# Altium schematic sheet BMS can bang thu dong 4N04R.SchDoc: BMS 300A G011N04
size 431 x 279 mm; CompanyName: AZE; Revision: 1.0.0; SheetNumber: 1; SheetTotal: 2
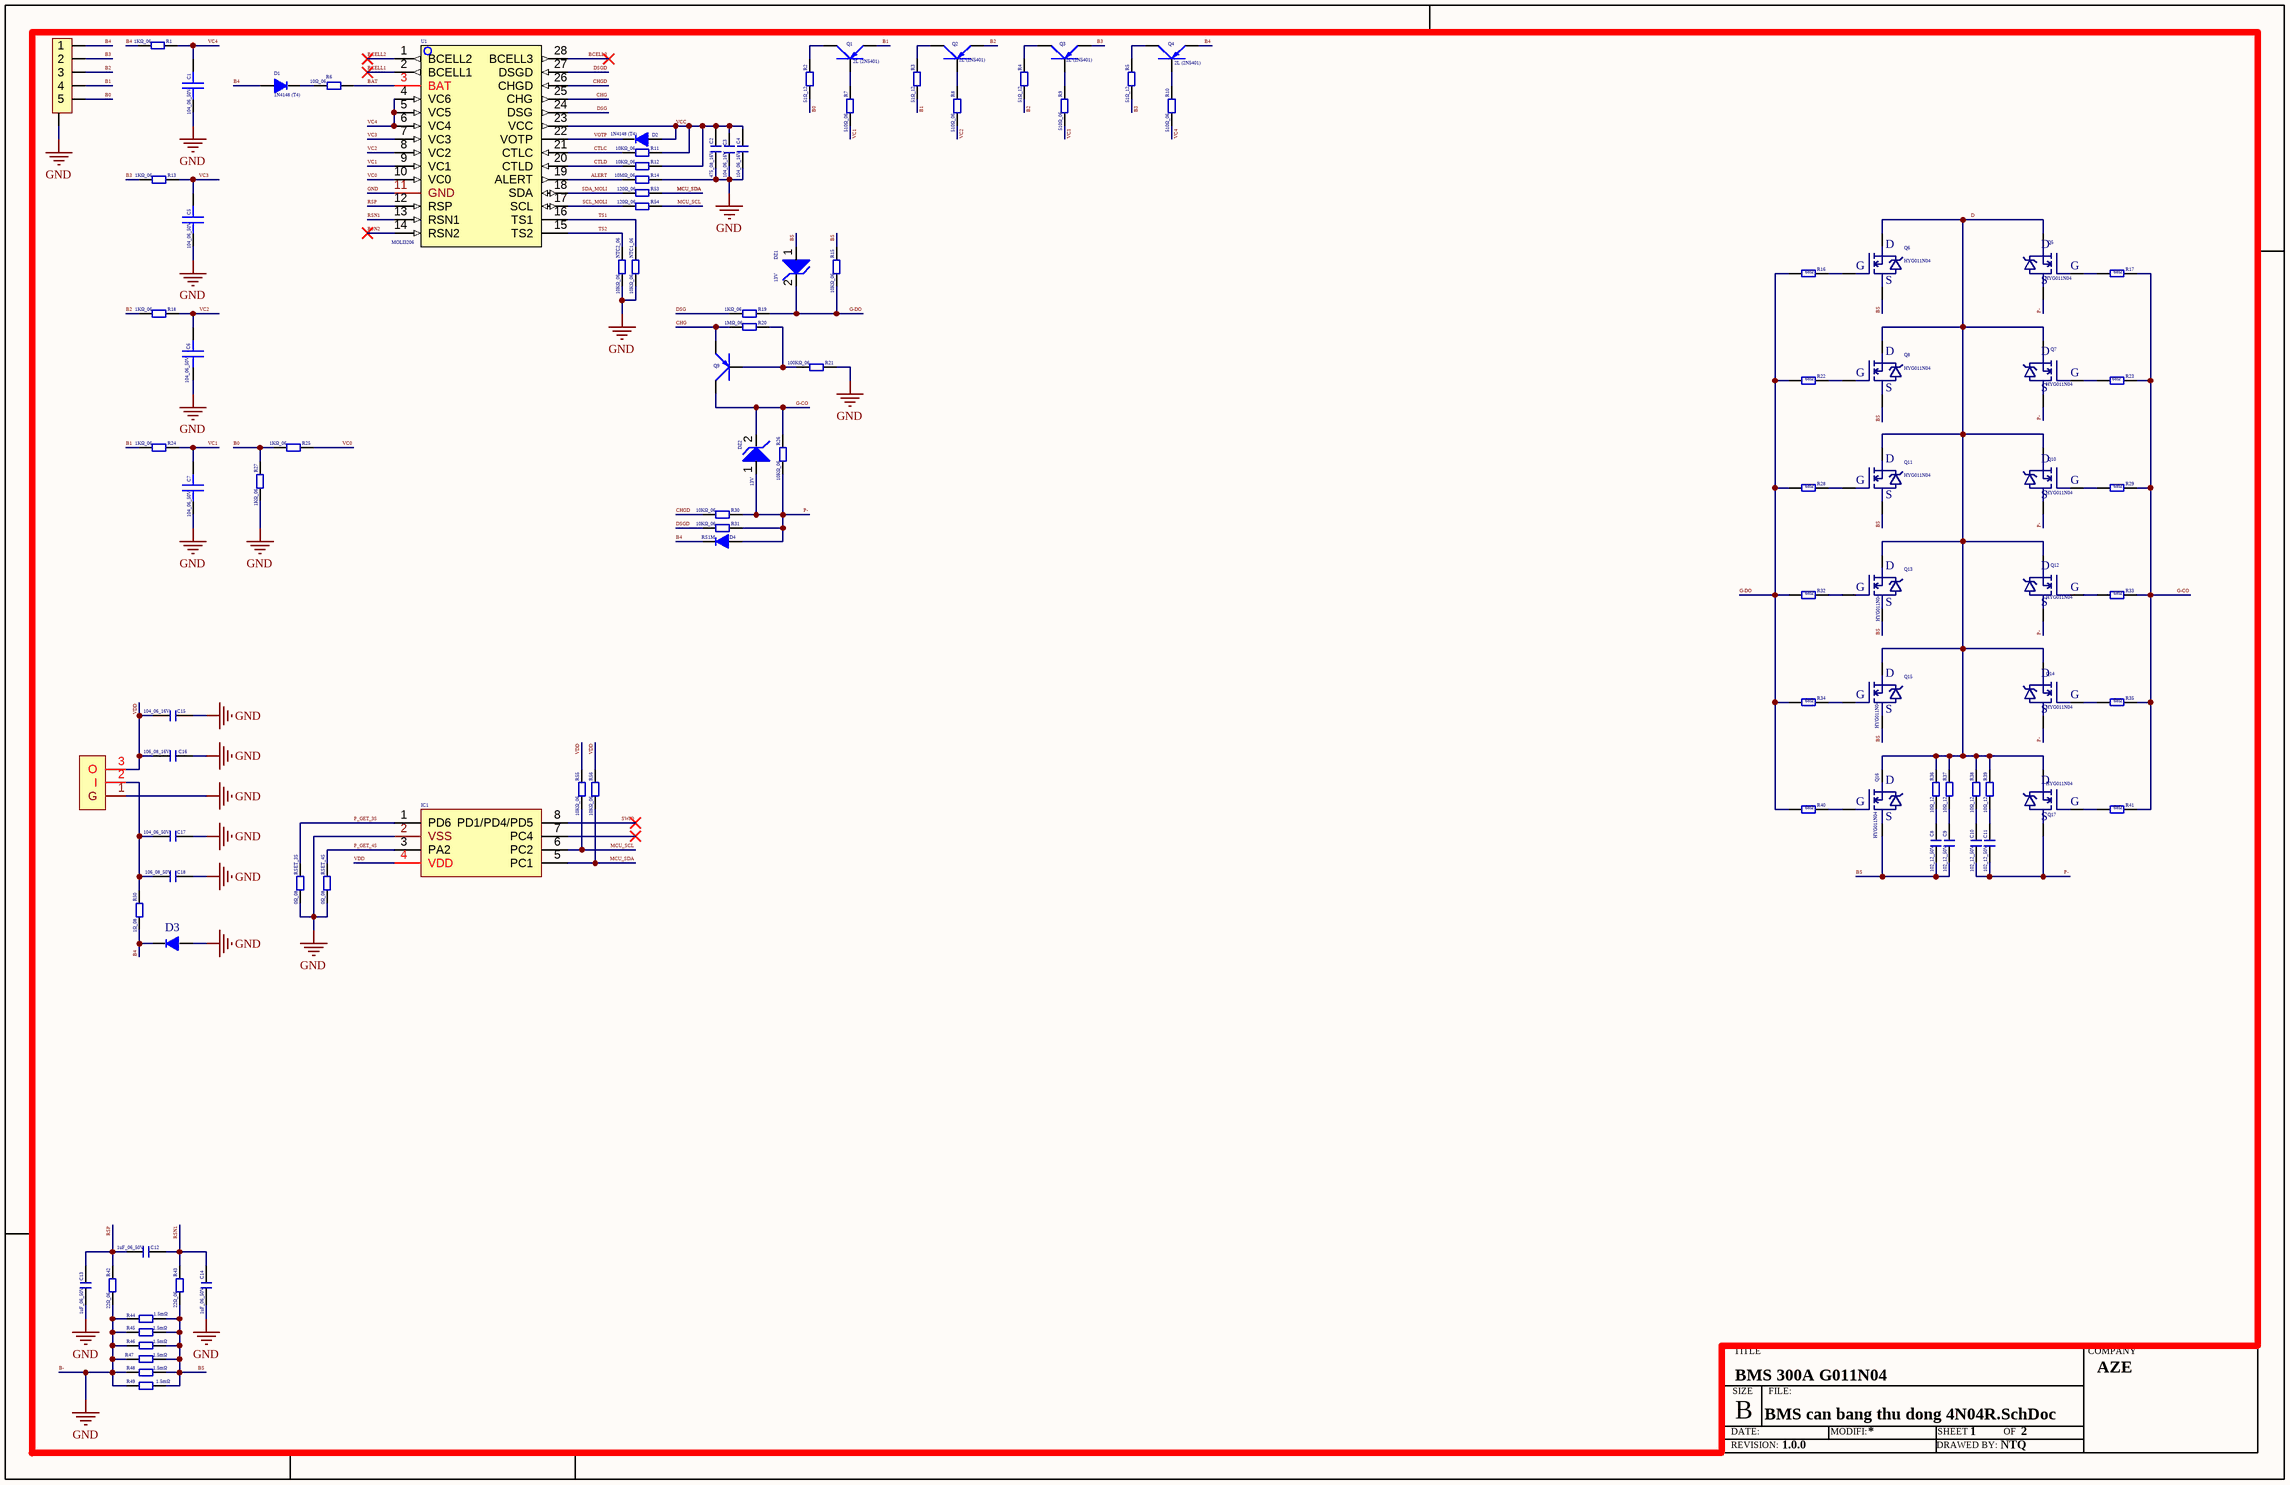
[diagram p0: BMS can bang thu dong 4N04R.SchDoc]

## Parts
C1  104_06_50V  [CAP 0603]
C2  475_08_16V  [CAP 0805]
C3  104_06_16V  [CAP 0603]
C4  104_06_16V  [CAP 0603]
C5  104_06_50V  [CAP 0603]
C6  104_06_50V  [CAP 0603]
C7  104_06_50V  [CAP 0603]
C8  102_12_50V  [CAPC 1206 (3216)]
C9  102_12_50V  [CAPC 1206 (3216)]
C10  102_12_50V  [CAPC 1206 (3216)]
C11  102_12_50V  [CAPC 1206 (3216)]
C12  1uF_06_50V  [CAP 0603]
C13  1uF_06_50V  [CAP 0603]
C14  1uF_06_50V  [CAP 0603]
C15  104_06_16V  [CAP 0603]
C16  106_08_16V  [CAP 0805]
C17  104_06_50V  [CAP 0603]
C18  106_08_50V  [CAP 0805]
CN?  header  [header 5p 2.54mm]  (value not drawn)
D1  1N4148 (T4)  [SOD-123(4148W-1206 part-part)]
D2  1N4148 (T4)  [SOD-123(4148W-1206 part-part)]
D3  SMAJ16A - PACKAGE DO214AC  [DIODE_DO214AC_SMA(RS1,.M7)]  (value not drawn)
D4  RS1M  [DIODE_DO214AC_SMA(RS1,.M7)]
DZ1  13V  [SOD-323(4148WS-0805)]
DZ2  13V  [SOD-323(4148WS-0805)]
IC1  CH32V003J4M6  [CH32V003J4M6]  (value not drawn)
NTC1_06  10KΩ_06  [RES 0603-1608 1/10W]
NTC2_06  10KΩ_06  [RES 0603-1608 1/10W]
Q1  2L (2N5401)  [SOT23B]
Q2  2L (2N5401)  [SOT23B]
Q3  2L (2N5401)  [SOT23B]
Q4  2L (2N5401)  [SOT23B]
Q5  HYG011N04  [FET khoi dong xe - duplicate]
Q6  HYG011N04  [FET khoi dong xe - duplicate]
Q7  HYG011N04  [FET khoi dong xe - duplicate]
Q8  HYG011N04  [FET khoi dong xe - duplicate]
Q9  2L (2N5401)  [SOT23B]  (value not drawn)
Q10  HYG011N04  [FET khoi dong xe - duplicate]
Q11  HYG011N04  [FET khoi dong xe - duplicate]
Q12  HYG011N04  [FET khoi dong xe - duplicate]
Q13  HYG011N04  [FET khoi dong xe - duplicate]
Q14  HYG011N04  [FET khoi dong xe - duplicate]
Q15  HYG011N04  [FET khoi dong xe - duplicate]
Q16  HYG011N04  [FET khoi dong xe - duplicate]
Q17  HYG011N04  [FET khoi dong xe - duplicate]
R1  1KΩ_06  [RES 0603-1608 1/10W]
R2  51Ω_12  [RES 2010-5025 3/4W]
R3  51Ω_12  [RES 2010-5025 3/4W]
R4  51Ω_12  [RES 2010-5025 3/4W]
R5  51Ω_12  [RES 2010-5025 3/4W]
R6  10Ω_06  [RES 0603-1608 1/10W]
R7  510Ω_06  [RES 0603-1608 1/10W]
R8  510Ω_06  [RES 0603-1608 1/10W]
R9  510Ω_06  [RES 0603-1608 1/10W]
R10  510Ω_06  [RES 0603-1608 1/10W]
R11  10KΩ_06  [RES 0603-1608 1/10W]
R12  10KΩ_06  [RES 0603-1608 1/10W]
R13  1KΩ_06  [RES 0603-1608 1/10W]
R14  10MΩ_06  [RES 0603-1608 1/10W]
R15  10KΩ_06  [RES 0603-1608 1/10W]
R16  68Ω  [RES 0603-1608 1/10W]
R17  68Ω  [RES 0603-1608 1/10W]
R18  1KΩ_06  [RES 0603-1608 1/10W]
R19  1KΩ_06  [RES 0603-1608 1/10W]
R20  1MΩ_06  [RES 0603-1608 1/10W]
R21  100KΩ_06  [RES 0603-1608 1/10W]
R22  68Ω  [RES 0603-1608 1/10W]
R23  68Ω  [RES 0603-1608 1/10W]
R24  1KΩ_06  [RES 0603-1608 1/10W]
R25  1KΩ_06  [RES 0603-1608 1/10W]
R26  10KΩ_06  [RES 0603-1608 1/10W]
R27  1KΩ_06  [RES 0603-1608 1/10W]
R28  68Ω  [RES 0603-1608 1/10W]
R29  68Ω  [RES 0603-1608 1/10W]
R30  10KΩ_06  [RES 0603-1608 1/10W]
R31  10KΩ_06  [RES 0603-1608 1/10W]
R32  68Ω  [RES 0603-1608 1/10W]
R33  68Ω  [RES 0603-1608 1/10W]
R34  68Ω  [RES 0603-1608 1/10W]
R35  68Ω  [RES 0603-1608 1/10W]
R36  10Ω_12  [RES 1206- 3216 1/4W]
R37  10Ω_12  [RES 1206- 3216 1/4W]
R38  10Ω_12  [RES 1206- 3216 1/4W]
R39  10Ω_12  [RES 1206- 3216 1/4W]
R40  68Ω  [RES 0603-1608 1/10W]
R41  68Ω  [RES 0603-1608 1/10W]
R42  22Ω_06  [RES 0603-1608 1/10W]
R43  22Ω_06  [RES 0603-1608 1/10W]
R44  1.5mΩ  [RES 2512-6332 1W]
R45  1.5mΩ  [RES 2512-6332 1W]
R46  1.5mΩ  [RES 2512-6332 1W]
R47  1.5mΩ  [RES 2512-6332 1W]
R48  1.5mΩ  [RES 2512-6332 1W]
R49  1.5mΩ  [RES 2512-6332 1W]
R50  1Ω_08  [RES 0805-2012 1/8W]
R53  120Ω_06  [RES 0603-1608 1/10W]
R54  120Ω_06  [RES 0603-1608 1/10W]
R55  10KΩ_06  [RES 0603-1608 1/10W]
R56  10KΩ_06  [RES 0603-1608 1/10W]
RSET_3S  0Ω_08  [RES 0805-2012 1/8W]
RSET_4S  0Ω_08  [RES 0805-2012 1/8W]
U1  MOLI3206  [TSSOP28-WIDE-BODY]
U2  HT7550-1  [SOT89]  (value not drawn)

## Nets
B-: C1.1 C2.1 C3.2 C4.1 C5.1 C6.1 C7.1 C13.2 C14.1 C15.1 C16.1 C17.1 C18.1 CN?.6 D3.1(A) IC1.2(VSS) NTC1_06.2 NTC2_06.2 R14.2 R21.1 R27.1 R42.1 R44.1 R45.1 R46.1 R47.1 R48.1 R49.1 RSET_3S.1 RSET_4S.1 U1.11(GND) U2.1(G)  [also labelled GND]
ALERT: R14.1 U1.19(ALERT)
B0: CN?.5 R2.1 R25.2 R27.2
B1: CN?.4 Q1.1(E) R3.1 R24.2
B2: CN?.3 Q2.1(E) R4.1 R18.2
B3: CN?.2 Q3.1(E) R5.1 R13.2
B4: CN?.1 D1.1(A) D3.2(K) D4.2(K) Q4.1(E) R1.2 R50.1
BAT: R6.1 U1.3(BAT)
BCELL1: U1.2(BCELL1)
BCELL2: U1.1(BCELL2)
BCELL3: U1.28(BCELL3)
BS: C8.1 C9.1 DZ1.1(A) Q6.3 Q8.3 Q11.3 Q13.3 Q15.3 Q16.3 R15.1 R43.1 R44.2 R45.2 R46.2 R47.2 R48.2 R49.2
CHG: Q9.1(E) R20.2 U1.25(CHG)
CHGD: R30.2 U1.26(CHGD)
CTLC: R11.1 U1.21(CTLC)
CTLD: R12.1 U1.20(CTLD)
D: Q5.2 Q6.2 Q7.2 Q8.2 Q10.2 Q11.2 Q12.2 Q13.2 Q14.2 Q15.2 Q16.2 Q17.2 R36.1 R37.1 R38.1 R39.1
DSG: R19.2 U1.24(DSG)
DSGD: R31.2 U1.27(DSGD)
G-CO: DZ2.2(K) Q9.2(C) R17.1 R23.1 R26.2 R29.1 R33.1 R35.1 R41.1
G-DO: DZ1.2(K) R15.2 R16.1 R19.1 R22.1 R28.1 R32.1 R34.1 R40.1
MCU_SCL: IC1.6(PC2) R54.2 R55.1
MCU_SDA: IC1.5(PC1) R53.2 R56.1
P-: C10.1 C11.1 D4.1(A) DZ2.1(A) Q5.3 Q7.3 Q10.3 Q12.3 Q14.3 Q17.3 R26.1 R30.1 R31.1
P_GET_3S: IC1.1(PD6) RSET_3S.2
P_GET_4S: IC1.3(PA2) RSET_4S.2
RSN1: C12.1 C14.2 R43.2 U1.13(RSN1)
RSN2: U1.14(RSN2)
RSP: C12.2 C13.1 R42.2 U1.12(RSP)
SCL_MOLI: R54.1 U1.17(SCL)
SDA_MOLI: R53.1 U1.18(SDA)
SWIO: IC1.8(PD1/PD4/PD5)
TS1: NTC1_06.1 U1.16(TS1)
TS2: NTC2_06.1 U1.15(TS2)
VC0: R25.1 U1.10(VC0)
VC1: C7.2 R7.2 R24.1 U1.9(VC1)
VC2: C6.2 R8.2 R18.1 U1.8(VC2)
VC3: C5.2 R9.2 R13.1 U1.7(VC3)
VC4: C1.2 R1.1 R10.2 U1.4(VC6) U1.5(VC5) U1.6(VC4)
VCC: C2.2 C3.1 C4.2 D2.1(A) R11.2 R12.2 U1.23(VCC)
VDD: C15.2 C16.2 IC1.4(VDD) R55.2 R56.2 U2.3(O)
VOTP: D2.2(K) U1.22(VOTP)
NetC8_2: C8.2 R36.2
NetC9_2: C9.2 R37.2
NetC10_2: C10.2 R38.2
NetC11_2: C11.2 R39.2
NetC17_2: C17.2 C18.2 R50.2 U2.2(I)
NetD1_2: D1.2(K) R6.2
NetQ1_2: Q1.2(C) R2.2
NetQ1_3: Q1.3(B) R7.1
NetQ2_2: Q2.2(C) R3.2
NetQ2_3: Q2.3(B) R8.1
NetQ3_2: Q3.2(C) R4.2
NetQ3_3: Q3.3(B) R9.1
NetQ4_2: Q4.2(C) R5.2
NetQ4_3: Q4.3(B) R10.1
NetQ5_1: Q5.1 R17.2
NetQ6_1: Q6.1 R16.2
NetQ7_1: Q7.1 R23.2
NetQ8_1: Q8.1 R22.2
NetQ9_3: Q9.3(B) R20.1 R21.2
NetQ10_1: Q10.1 R29.2
NetQ11_1: Q11.1 R28.2
NetQ12_1: Q12.1 R33.2
NetQ13_1: Q13.1 R32.2
NetQ14_1: Q14.1 R35.2
NetQ15_1: Q15.1 R34.2
NetQ16_1: Q16.1 R40.2
NetQ17_1: Q17.1 R41.2

Not connected (* = marked no-connect by the designer): IC1 7(PC4)*

## Notes on the sheet
- TITLE
- COMPANY
- DATE:
- SIZE
- B
- FILE:
- MODIFI:
- SHEET
- OF
- REVISION:
- DRAWED BY:
- NTQ
- (in symbol FET to khoi dong xe) D; G; S

## Library data of the parts
C1 C5-C7 = C0603C102K5RACTU: CAP CER 1nF 50V 10% X7R 0603; CompanyID: VT-00573; Solder: SMT; Value: 102/50V; MPN: C0603C102K5RACTU; Category: CAPACITOR; PinCount: 2
C2-C4 C8-C18 = CAP-SMD
D1 D3 D4 = DIODE
D2 = DIODE: 1N4148 (T4 SOD123)
DZ1 DZ2 = ZENNER: DIODE ZENNER BZT52C5V6 SOD123
IC1 = CH32V003J4M6: CH32V003J4M6 - RISC-V MCU, 48MHz, 16KB Flash, 2KB SRAM / + Package: SOP-8 / + Voltage: 3.3V - 5V / + I/O: 6 Pins / + Timers: 1 Advanced, 1 General, 2 Watchdog / + Communication: ADC, I2C, USART
NTC1_06 NTC2_06 R1-R50 R53-R56 RSET_3S RSET_4S = RES SMD
Q1-Q4 Q9 = A1015: PNP 600mW, ECB; Value: A1015
Q5-Q8 Q10-Q17 = FET to khoi dong xe
U1 = MOLI3206: BMS 3S to 6S
U2 = 75xx-1: LDO 100mA, Vin_max = 24V.